# EasyEDA Pro project stm32f103c8t6.eprj

# Schematic Schematic1
Create Date: 2023-07-21; Page Name: P1; Project Name: stm32f103c8t6; Schematic Name: Schematic1; Update Date: 2023-07-23; Company: 嘉立创EDA; Page Size: A4; Version: V1.0
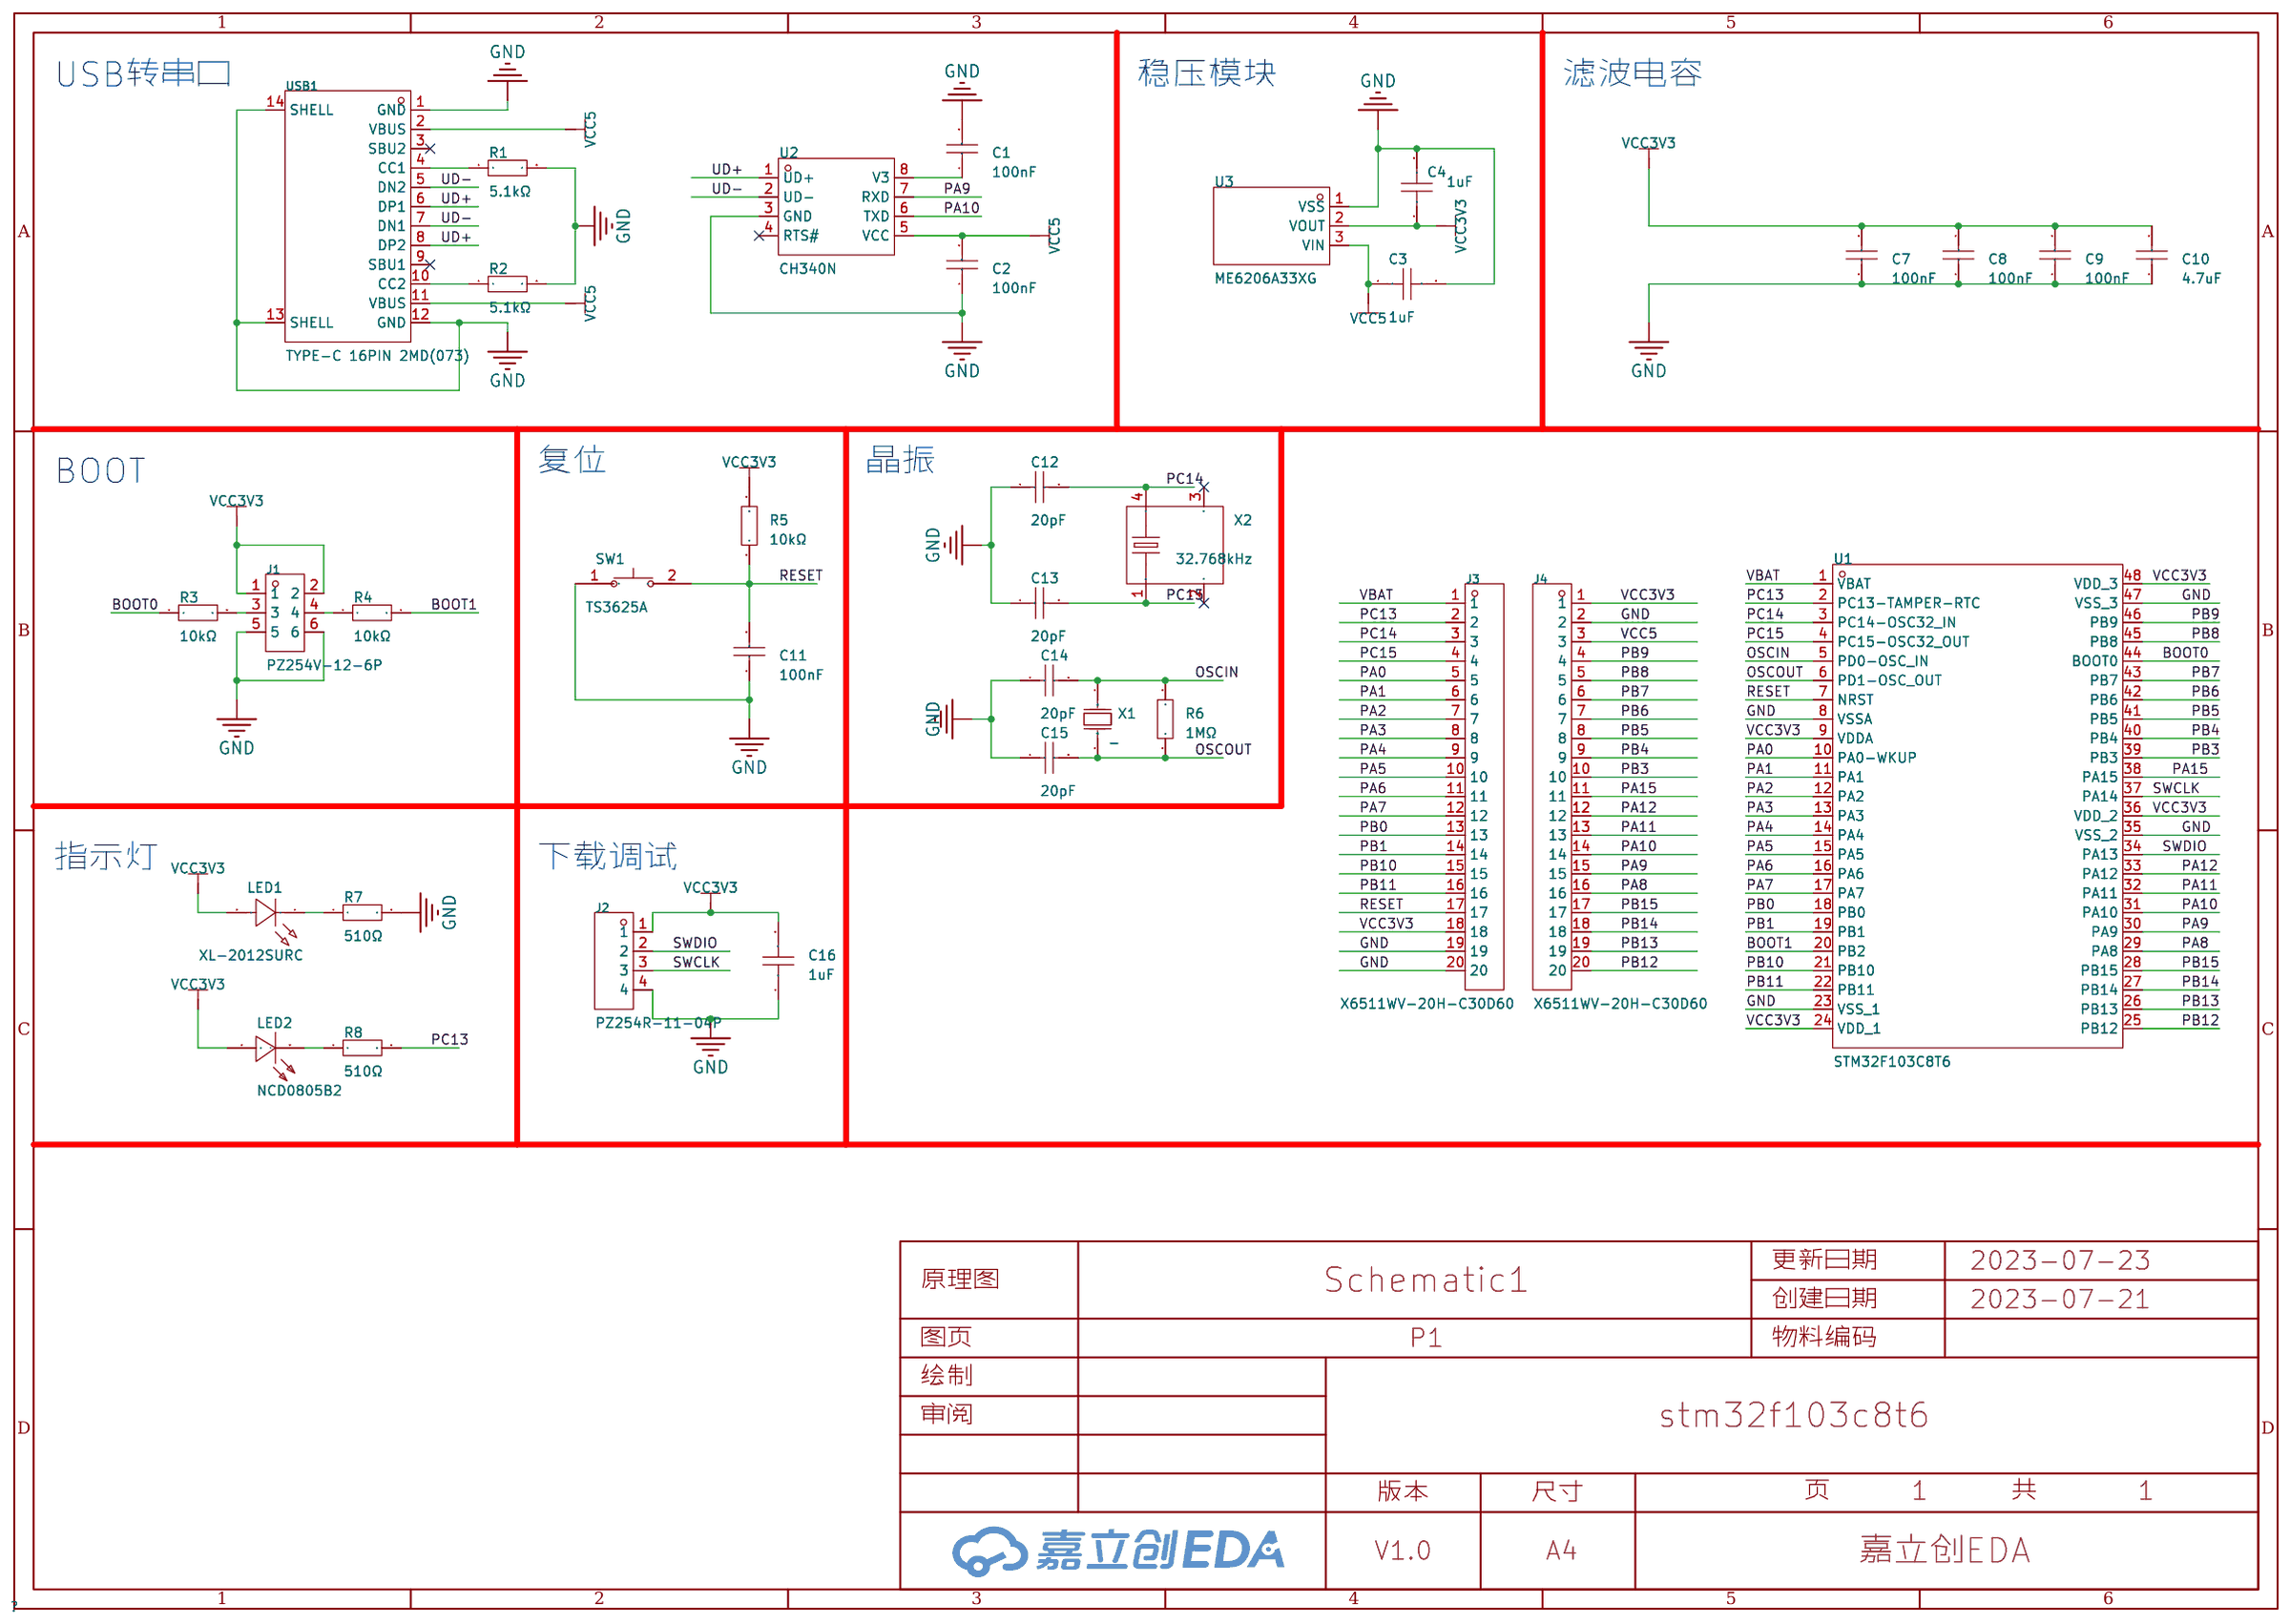
[diagram p0: schematic sheet]

## Parts
C1  100nF  [C0603]
C2  100nF  [C0603]
C3  1uF  [C0603]
C4  1uF  [C0603]
C7  100nF  [C0603]
C8  100nF  [C0603]
C9  100nF  [C0603]
C10  4.7uF  [C0603]
C11  100nF  [C0603]
C12  20pF  [C0603]
C13  20pF  [C0603]
C14  20pF  [C0603]
C15  20pF  [C0603]
C16  1uF  [C0603]
J1  PZ254V-12-6P  [HDR-TH_6P-P2.54-V-M-R2-C3-S2.54]
J2  PZ254R-11-04P  [HDR-TH_4P-P2.54-H-M-W10.4]
J3  X6511WV-20H-C30D60  [HDR-TH_20P-P2.54-V-M]
J4  X6511WV-20H-C30D60  [HDR-TH_20P-P2.54-V-M]
LED1  XL-2012SURC  [LED0805-RD_RED]
LED2  NCD0805B2  [LED0805-R-RD]
R1  5.1kΩ  [R0603]
R2  5.1kΩ  [R0603]
R3  10kΩ  [R0603]
R4  10kΩ  [R0603]
R5  10kΩ  [R0603]
R6  1MΩ  [R0603]
R7  510Ω  [R0603]
R8  510Ω  [R0603]
SW1  TS3625A  [KEY-SMD_L6.0-W3.5-LS8.4]
U1  STM32F103C8T6  [LQFP-48_L7.0-W7.0-P0.50-LS9.0-BL]
U2  CH340N  [SOP-8_L5.0-W4.0-P1.27-LS6.0-BL]
U3  ME6206A33XG  [SOT-23-3_L2.9-W1.6-P1.90-LS2.8-BR]
USB1  TYPE-C 16PIN 2MD(073)  [USB-C-SMD_TYPE-C-6PIN-2MD-073]
X1  -  [HC-49US_L11.5-W4.5-P4.88]
X2  32.768kHz  [MC-306_4P-L8.0-W3.2-P5.5-BL]

## Library data of the parts
C1 C2 C7-C9 C11 = 0603B104K500NT: 容值:100nF;精度:±10%;额定电压:50V;材质(温度系数):X7R;; LCSC Part Name: 100nF ±10% 50V; Supplier Part: C30926; Manufacturer: FH(风华); Supplier Footprint: 0603; JLCPCB Part Class: Extended Part; Datasheet: https://atta.szlcsc.com/upload/public/pdf/source/20170923/C30926_1506149436298988724.pdf; Supplier: LCSC; Tolerance: ±10%; Voltage Rated: 50V; Temperature Coefficient: X7R
C3 C4 C16 = 0603B105K500NT: 温度系数:X7R;精度:±10%;额定电压:50V;容值:1uF;; LCSC Part Name: 1uF(105) ±10% 50V; Supplier Part: C90540; Manufacturer: FH(风华); Supplier Footprint: 0603; JLCPCB Part Class: Extended Part; Datasheet: https://atta.szlcsc.com/upload/public/pdf/source/20170923/C90540_1506149560830988967.pdf; Supplier: LCSC; Temperature Coefficient: X7R; Tolerance: ±10%; Voltage Rated: 50V
C10 = CL10A475KO8NNNC: 容值:4.7uF;精度:±10%;额定电压:16V;材质(温度系数):X5R;; LCSC Part Name: 4.7uF ±10% 16V; Supplier Part: C19666; Manufacturer: SAMSUNG(三星); Supplier Footprint: 0603; JLCPCB Part Class: Basic Part; Datasheet: https://atta.szlcsc.com/upload/public/pdf/source/20160103/1457707703134.pdf; Supplier: LCSC; Tolerance: ±10%; Voltage Rated: 16V; Temperature Coefficient: X5R
C12-C15 = CC0603JRNPO9BN200: 容值:20pF;精度:±5%;额定电压:50V;材质(温度系数):NP0;; LCSC Part Name: 20pF ±5% 50V; Supplier Part: C105621; Manufacturer: YAGEO(国巨); Supplier Footprint: 0603; JLCPCB Part Class: Extended Part; Datasheet: https://atta.szlcsc.com/upload/public/pdf/source/20170425/1493115771885.pdf; Supplier: LCSC; Tolerance: ±5%; Voltage Rated: 50V; Temperature Coefficient: NP0
J1 = PZ254V-12-6P: 排数:双排;总PIN位数:6P;间距:2.54mm;插针结构:2x3P;行距:2.54mm;安装类型:直插;圆针/方针:方针;额定电流:-;额定电压:-;配合针长度:6mm;塑高:2.5mm;端接针长度:3mm;触头材质:黄铜;触头镀层:-;工作温度范围:-40℃~+105℃;颜色:黑色;; LCSC Part Name: 2.54mm 2x3P 直插 方针; Supplier Part: C492420; Manufacturer: XFCN(兴飞); Supplier Footprint: 插件,P=2.54mm; JLCPCB Part Class: Extended Part; Datasheet: https://atta.szlcsc.com/upload/public/pdf/source/20200309/C492420_BAECB307B001054C09D200388220EAE6.pdf; Supplier: LCSC; Number of Rows: 双排; Number of Pins: 6P; Pitch: 2.54mm; Pin Structure: 2x3P; Row Spacing: 2.54mm; Mounting Type: 直插; Circluar Pins/Square Pins: 方针; Length of Mating Pin: 6mm; Insulation Height: 2.5mm; Length of End Connection Pin: 3mm; Contact Material: 黄铜; Operating Temperature Range: -40℃~+105℃; Color: 黑色
J2 = PZ254R-11-04P: 间距:2.54mm;总PIN位数:4;排数:1;插针结构:1x4P;行距:-;安装类型:弯插;圆针/方针:方针;额定电流:-;额定电压:-;配合针长度:6mm;塑高:2.5mm;触头材质:黄铜;触头镀层:-;工作温度范围:-40℃~+105℃;颜色:黑色;; LCSC Part Name: 2.54mm 1x4P 弯插 方针; Supplier Part: C492412; Manufacturer: XFCN(兴飞); Supplier Footprint: 插件,P=2.54mm; JLCPCB Part Class: Extended Part; Supplier: LCSC; Pitch: 2.54mm; Number of Pins: 4; Number of Rows: 1; Pin Structure: 1x4P; Mounting Type: 弯插; Circluar Pins/Square Pins: 方针; Length of Mating Pin: 6mm; Insulation Height: 2.5mm; Contact Material: 黄铜; Operating Temperature Range: -40℃~+105℃; Color: 黑色
J3 J4 = X6511WV-20H-C30D60: 排数:单排;总PIN位数:20;间距:2.54mm;插针结构:1x20P;行距:-;安装类型:直插;圆针/方针:方针;额定电流:3A;额定电压:250V;配合针长度:6mm;塑高:2.5mm;端接针长度:3mm;触头材质:黄铜;触头镀层:金;工作温度范围:-40℃~+105℃;焊接温度(最大值):260℃;颜色:黑色;; LCSC Part Name: 2.54mm 1x20P 直插 方针; Supplier Part: C725952; Manufacturer: XKB Connectivity(中国星坤); Supplier Footprint: 插件,P=2.54mm; JLCPCB Part Class: Extended Part; Supplier: LCSC; Number of Rows: 单排; Number of Pins: 20; Pitch: 2.54mm; Pin Structure: 1x20P; Mounting Type: 直插; Circluar Pins/Square Pins: 方针; Current Rating (Max): 3A; Voltage Rating (Max): 250V; Length of Mating Pin: 6mm; Insulation Height: 2.5mm; Length of End Connection Pin: 3mm; Contact Material: 黄铜; Contact Plating: 金; Operating Temperature Range: -40℃~+105℃; Welding Temperature (Max): 260℃; Color: 黑色
LED1 = XL-2012SURC: 发光颜色:红灯;主波长:617nm~621nm;色温:-;功率:55mW;安装方式:正贴;; LCSC Part Name: 红灯 正贴; Supplier Part: C965812; Manufacturer: XINGLIGHT(成兴光); Supplier Footprint: 0805; JLCPCB Part Class: Extended Part; Datasheet: https://atta.szlcsc.com/upload/public/pdf/source/20221102/49E1A0A365644091E6270AF1C5E0FE37.pdf; Supplier: LCSC; Emitted Color: 红灯; Lens Color: 无色透明; Dominant Wavelength: 617nm~621nm; Peak Wavelength: 623nm; Forward Current: 25mA; Power Dissipation: 55mW; Viewing Angle: 120°; Mounting Sytle: 正贴; Operating Temperature: -30℃~+85℃
LED2 = NCD0805B2: 发光颜色:蓝灯;; LCSC Part Name: 蓝灯; Supplier Part: C84259; Manufacturer: 国星光电; Supplier Footprint: 0805; JLCPCB Part Class: Extended Part; Datasheet: https://atta.szlcsc.com/upload/public/pdf/source/20200820/C84259_E5AC6865415989C4C2C2831134BA3A23.pdf; Supplier: LCSC; Emitted Color: 蓝灯
R1 R2 = 0603WAF5101T5E: 电阻类型:厚膜电阻;阻值:5.1kΩ;精度:±1%;功率:100mW;; LCSC Part Name: 5.1kΩ ±1% 100mW; Supplier Part: C23186; Manufacturer: UNI-ROYAL(厚声); Supplier Footprint: 0603; JLCPCB Part Class: Basic Part; Datasheet: https://atta.szlcsc.com/upload/public/pdf/source/20200306/C422600_1E6D84923E4A46A82E41ADD87F860B5C.pdf; Supplier: LCSC; Type: 厚膜电阻; Tolerance: ±1%; Power(Watts): 100mW; Temperature Coefficient: ±100ppm/℃; Overload Voltage (Max): 75V; Operating Temperature Range: -55℃~+155℃
R3-R5 = 0603WAF1002T5E: 电阻类型:厚膜电阻;阻值:10kΩ;精度:±1%;功率:100mW;; LCSC Part Name: 厚膜电阻 10kΩ ±1% 100mW; Supplier Part: C25804; Manufacturer: UNI-ROYAL(厚声); Supplier Footprint: 0603; JLCPCB Part Class: Basic Part; Datasheet: https://atta.szlcsc.com/upload/public/pdf/source/20200306/C422600_1E6D84923E4A46A82E41ADD87F860B5C.pdf; Supplier: LCSC; Type: 厚膜电阻; Tolerance: ±1%; Power(Watts): 100mW; Temperature Coefficient: ±100ppm/℃; Overload Voltage (Max): 75V; Operating Temperature Range: -55℃~+155℃
R6 = 0603WAF1004T5E: 电阻类型:厚膜电阻;阻值:1MΩ;精度:±1%;功率:100mW;; LCSC Part Name: 1MΩ ±1% 100mW; Supplier Part: C22935; Manufacturer: UNI-ROYAL(厚声); Supplier Footprint: 0603; JLCPCB Part Class: Basic Part; Datasheet: https://atta.szlcsc.com/upload/public/pdf/source/20200306/C422600_1E6D84923E4A46A82E41ADD87F860B5C.pdf; Supplier: LCSC; Type: 厚膜电阻; Tolerance: ±1%; Power(Watts): 100mW; Temperature Coefficient: ±100ppm/℃; Overload Voltage (Max): 75V; Operating Temperature Range: -55℃~+155℃
R7 R8 = 0603WAF5100T5E: 电阻类型:厚膜电阻;阻值:510Ω;精度:±1%;功率:100mW;; LCSC Part Name: 510Ω ±1% 100mW; Supplier Part: C23193; Manufacturer: UNI-ROYAL(厚声); Supplier Footprint: 0603; JLCPCB Part Class: Basic Part; Datasheet: https://atta.szlcsc.com/upload/public/pdf/source/20200306/C422600_1E6D84923E4A46A82E41ADD87F860B5C.pdf; Supplier: LCSC; Type: 厚膜电阻; Tolerance: ±1%; Power(Watts): 100mW; Temperature Coefficient: ±100ppm/℃; Overload Voltage (Max): 75V; Operating Temperature Range: -55℃~+155℃
SW1 = TS3625A: 触点电流:50mA;额定电压(DC):12V;电路结构:单刀单掷;安装方式:立贴;带灯:-;作用力:250gf@±50gf;机械寿命:-;; LCSC Part Name: 6.1*3.65*2.5mm 立贴 轻触开关; Supplier Part: C398053; Manufacturer: SHOU HAN(首韩); Supplier Footprint: SMD; JLCPCB Part Class: Extended Part; Datasheet: https://atta.szlcsc.com/upload/public/pdf/source/20190620/C398053_EFFFB524A3F966B1F45EE8333D1EDECC.pdf; Supplier: LCSC; Contact Current: 50mA; Voltage Rating (DC): 12V; Circuit: 单刀单掷; Mounting Style: 立贴; Actuator Style: 矩形按钮; Operating Force: 250gf@±50gf; Switch Length: 6.1mm; Switch Width: 3.65mm; Switch Height: 2.5mm
U1 = STM32F103C8T6: CPU内核:ARM Cortex-M3;CPU最大主频:72MHz;程序存储容量:64KB;程序存储器类型:FLASH;RAM总容量:20KB;GPIO端口数量:37;; LCSC Part Name: ARM Cortex-M3 72MHz MSL=3; Supplier Part: C8734; Manufacturer: ST(意法半导体); Supplier Footprint: LQFP-48(7x7); JLCPCB Part Class: Basic Part; Datasheet: https://atta.szlcsc.com/upload/public/pdf/source/20220812/8363ACEC51AD55ECEB84799464F7CB85.pdf; Supplier: LCSC; CPU Core: ARM Cortex-M3; CPU Maximum Speed: 72MHz; Operating Voltage Range: 2V~3.6V; Program Storage Size: 64KB; Program Memory Type: FLASH; RAM Size: 20KB; GPIO Ports Number: 37; ADC (Bit): 12bit; Universal Serial Bus: 有; Peripheral/Function: 看门狗；DMA；看门狗；片载温度传感器; Watchdog: 有; Infrared Data Association: 有; Low-Voltage Detect: 有; Direct Memory Access: 有; Internal Oscillator: 有; Operating Temperature Range: -40℃~+85℃
U2 = CH340N_C506813: 应用功能:-;接口协议:-;; LCSC Part Name: USB转串口芯片 CH340; Supplier Part: C506813; Manufacturer: WCH(南京沁恒); Supplier Footprint: SOP-8; JLCPCB Part Class: Extended Part; Datasheet: https://atta.szlcsc.com/upload/public/pdf/source/20200819/C84681_ADBED554CE321879DBD6B1D06488689C.pdf; Supplier: LCSC
U3 = ME6206A33XG: 输出类型:固定;输出极性:正;最大输入电压:6V;输出电压:3.3V;输出电流:300mA;电源纹波抑制比(PSRR):50dB@(1kHz);; LCSC Part Name: 输入6V 输出3.3V 300mA; Supplier Part: C161345; Manufacturer: MICRONE(南京微盟); Supplier Footprint: SOT-23; JLCPCB Part Class: Extended Part; Datasheet: https://atta.szlcsc.com/upload/public/pdf/source/20180207/C161345_15179949863651359188.pdf; Supplier: LCSC; Output Type: 固定; Output Polarity: 正; Number of Outputs: 1; Maximum Input Voltage: 6V; Output Voltage: 3.3V; Dropout Voltage: 400mV@(200mA); Output Current: 300mA; Power Supply Rejection Ratio (PSRR): 50dB@(1kHz)
USB1 = TYPE-C 16PIN 2MD(073): 连接器类型:Type-C;标准:-;公母:母座;触点数量:16;端口数量:1;安装方式:卧贴;额定电流 - 电源:5A;工作温度范围:-25℃~+85℃;; LCSC Part Name: TYPE-C母座 16P 4脚插件带定位柱 不锈钢外壳 2次模顶; Supplier Part: C2765186; Manufacturer: SHOU HAN(首韩); Supplier Footprint: SMD; JLCPCB Part Class: Extended Part; Supplier: LCSC; Connector Type: Type-C; Gender: 母座; Number of Contacts: 16; Number of Ports: 1; Mounting Style: 卧贴; Current Rating - Power (Max): 5A; Operating Temperature Range: -25℃~+85℃
X1 = XIHCELNANF-8MHZ: 频率:-;负载电容:-;; LCSC Part Name: 8MHZ 20PF30PPM -40℃~+85℃DIP; Supplier Part: C295088; Manufacturer: TAITIEN(泰艺电子); Supplier Footprint: HC-49S; JLCPCB Part Class: Extended Part; Datasheet: https://atta.szlcsc.com/upload/public/pdf/source/20180928/C295088_870B1C8FD6918B666D832F79126576C6.pdf; Supplier: LCSC; Frequency Tolerance: ±20ppm; Frequency Stability: ±30ppm
X2 = Q13MC3062000600: 频率:32.768kHz;频率公差:±20ppm;负载电容:6pF;; LCSC Part Name: 32.768kHz ±20ppm 6pF; Supplier Part: C83979; Manufacturer: EPSON(爱普生); Supplier Footprint: MC-306; JLCPCB Part Class: Extended Part; Datasheet: https://atta.szlcsc.com/upload/public/pdf/source/20161024/1477288588328.pdf; Supplier: LCSC; Crystal Type: 贴片无源晶振; Frequency Tolerance: ±20ppm; Load Capacitance: 6pF; Equivalent Series Resistance (ESR): 35kΩ; Operating Temperature: -40℃~+85℃

## Nets
GND: C1.2 C2.1 C3.2 C4.2 C7.1 C8.1 C9.1 C10.1 C11.1 C12.1 C13.1 C14.1 C15.1 C16.1 J1.5 J1.6 J2.4 J3.19 J3.20 J4.2 LED1.1(K) R1.2 R2.2 R7.1 R7.2 SW1.1 U1.8(VSSA) U1.23(VSS_1) U1.35(VSS_2) U1.47(VSS_3) U2.3(GND) U3.1(VSS) USB1.1(GND) USB1.12(GND) USB1.13(SHELL) USB1.14(SHELL)
VBAT: J3.1 U1.1(VBAT)
VCC3V3: C4.1 C7.2 C8.2 C9.2 C10.2 C16.2 J1.1 J1.2 J2.1 J3.18 J4.1 LED1.2(A) LED2.1(+) R5.2 U1.9(VDDA) U1.24(VDD_1) U1.36(VDD_2) U1.48(VDD_3) U3.2(VOUT)
VCC5: C2.2 C3.1 J4.3 U2.5(VCC) U3.3(VIN) USB1.2(VBUS) USB1.11(VBUS)
BOOT0: R3.1 U1.44(BOOT0)
BOOT1: R4.2 U1.20(PB2)
OSCIN: C14.2 R6.2 U1.5(PD0-OSC_IN) X1.1(OSC1)
OSCOUT: C15.2 R6.1 U1.6(PD1-OSC_OUT) X1.2(OSC2)
PA0: J3.5 U1.10(PA0-WKUP)
PA1: J3.6 U1.11(PA1)
PA2: J3.7 U1.12(PA2)
PA3: J3.8 U1.13(PA3)
PA4: J3.9 U1.14(PA4)
PA5: J3.10 U1.15(PA5)
PA6: J3.11 U1.16(PA6)
PA7: J3.12 U1.17(PA7)
PA8: J4.16 U1.29(PA8)
PA9: J4.15 U1.30(PA9) U2.7(RXD)
PA10: J4.14 U1.31(PA10) U2.6(TXD)
PA11: J4.13 U1.32(PA11)
PA12: J4.12 U1.33(PA12)
PA15: J4.11 U1.38(PA15)
PB0: J3.13 U1.18(PB0)
PB1: J3.14 U1.19(PB1)
PB3: J4.10 U1.39(PB3)
PB4: J4.9 U1.40(PB4)
PB5: J4.8 U1.41(PB5)
PB6: J4.7 U1.42(PB6)
PB7: J4.6 U1.43(PB7)
PB8: J4.5 U1.45(PB8)
PB9: J4.4 U1.46(PB9)
PB10: J3.15 U1.21(PB10)
PB11: J3.16 U1.22(PB11)
PB12: J4.20 U1.25(PB12)
PB13: J4.19 U1.26(PB13)
PB14: J4.18 U1.27(PB14)
PB15: J4.17 U1.28(PB15)
PC13: J3.2 R8.2 U1.2(PC13-TAMPER-RTC)
PC14: C12.2 J3.3 U1.3(PC14-OSC32_IN) X2.4
PC15: C13.2 J3.4 U1.4(PC15-OSC32_OUT) X2.1
RESET: C11.2 J3.17 R5.1 SW1.2 U1.7(NRST)
SWCLK: J2.3 U1.37(PA14)
SWDIO: J2.2 U1.34(PA13)
UD+: U2.1(UD+) USB1.6(DP1) USB1.8(DP2)
UD-: U2.2(UD-) USB1.5(DN2) USB1.7(DN1)
$1N6641: R1.1 USB1.4(CC1)
$1N6644: R2.1 USB1.10(CC2)
$1N6955: C1.1 U2.8(V3)
$1N7700: J1.3 R3.2
$1N7707: J1.4 R4.1
$1N8347: LED2.2(-) R8.1

Not connected (* = marked no-connect by the designer): U2 4(RTS#)*; USB1 3(SBU2)* 9(SBU1)*; X2 2* 3*

## Notes on the sheet
- USB转串口
- 稳压模块
- 滤波电容
- 复位
- 晶振
- BOOT
- 指示灯
- 下载调试

# Board PCB1
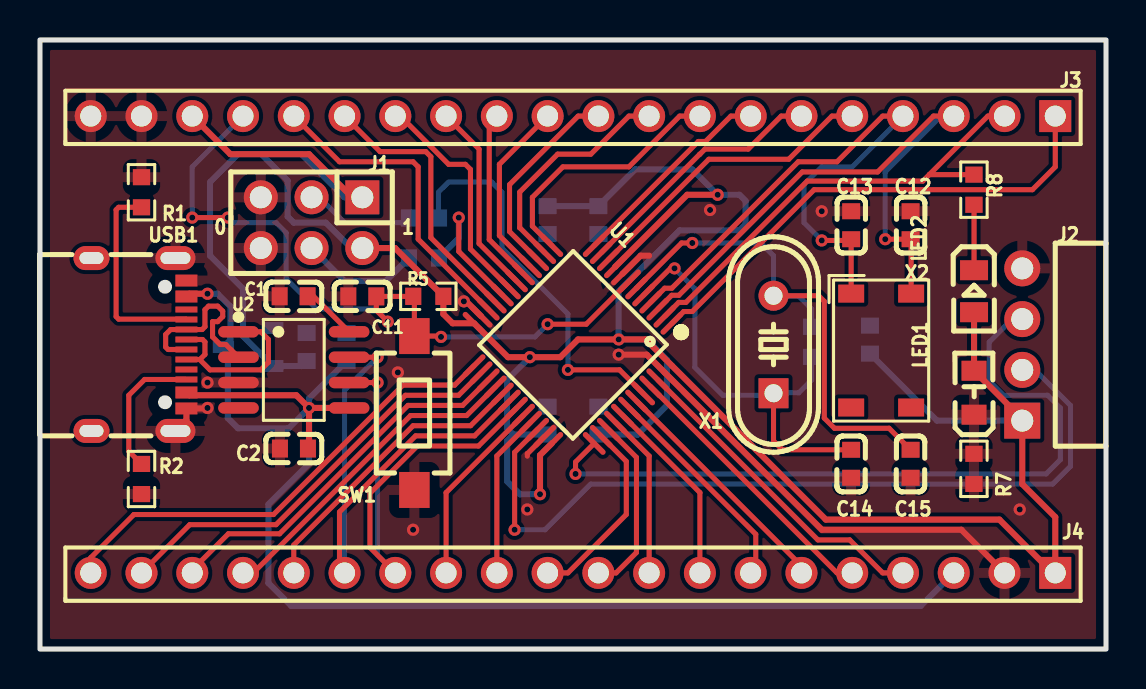
[diagram p1: board, top side]
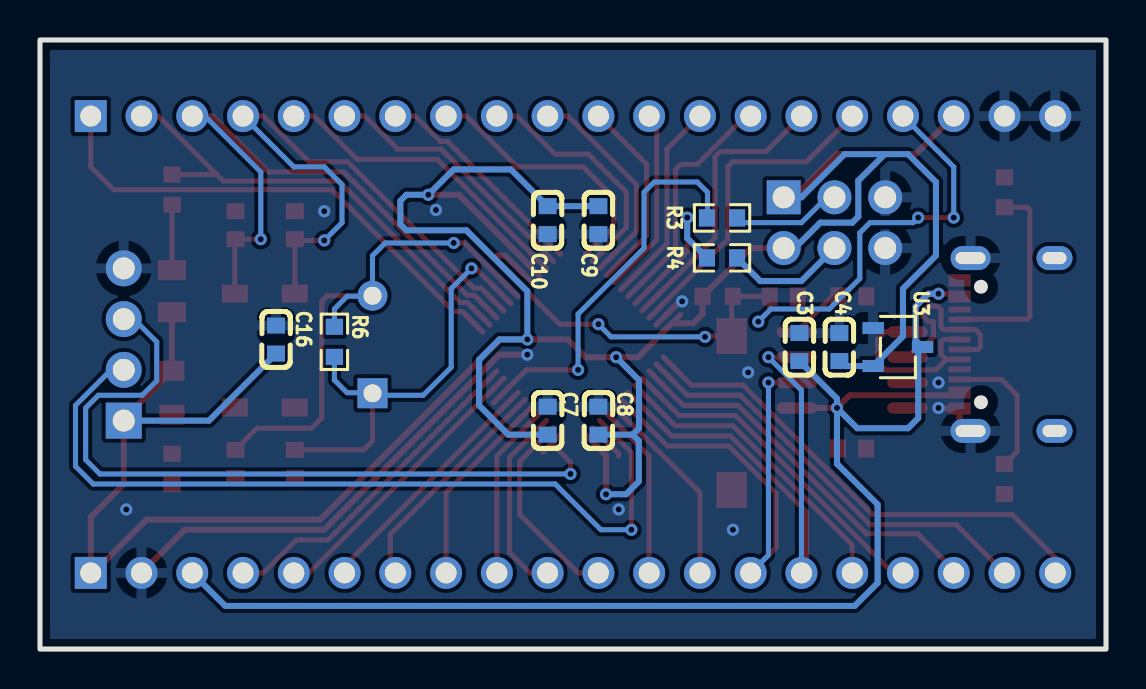
[diagram p2: board, bottom side, seen from below]

Outline 53.34 x 30.48 mm; copper layers: Top Layer, Bottom Layer. Coordinates in mm from the lower left corner of the outline.
Outline path: rectangle 0,30.48 53.34,0
Stack: Top Layer 0.035mm / Dielectric1 1.51mm FR4 er 4.5 / Bottom Layer 0.035mm

## Design rules (mm)
net UD-: DP1
net UD+: DP1
template: JLCPCB Capability(Two Layers Board)
spacing copperThickness1oz (default): track to track 0.102, other pairs 0.152 to 0.3
spacing copperThickness2oz: track to track 0.203, other pairs 0.152 to 0.3
track width copperThickness1oz (default): min 0.127, default 0.254, max 2.54
track width copperThickness2oz: min 0.203, default 0.254, max 2.54
differential pair differentialPair (default): width min 0.127, default 0.254, max 2.54; gap min 0.152, default 0.152
via viaSize (default): diameter min 0.5, default 0.61, max 10; hole min 0.3, default 0.305, max 6.3

## Placement (name value [footprint] x y rotation side)
C1  100nF  [C0603]  12.69 17.65 180 top
C2  100nF  [C0603]  12.71 10.03 0 top
C3  1uF  [C0603]  15.34 15.11 90 bottom
C4  1uF  [C0603]  13.34 15.11 90 bottom
C7  100nF  [C0603]  27.94 11.43 270 bottom
C8  100nF  [C0603]  25.4 11.43 270 bottom
C9  100nF  [C0603]  25.4 21.46 90 bottom
C10  4.7uF  [C0603]  27.94 21.46 90 bottom
C11  100nF  [C0603]  16.13 17.65 0 top
C12  20pF  [C0603]  43.56 21.21 270 top
C13  20pF  [C0603]  40.59 21.21 270 top
C14  20pF  [C0603]  40.59 9.27 90 top
C15  20pF  [C0603]  43.56 9.27 90 top
C16  1uF  [C0603]  41.53 15.49 270 bottom
J1  PZ254V-12-6P  [HDR-TH_6P-P2.54-V-M-R2-C3-S2.54]  13.59 21.34 180 top
J2  PZ254R-11-04P  [HDR-TH_4P-P2.54-H-M-W10.4]  49.15 15.24 90 top
J3  X6511WV-20H-C30D60  [HDR-TH_20P-P2.54-V-M]  26.67 26.67 180 top
J4  X6511WV-20H-C30D60  [HDR-TH_20P-P2.54-V-M]  26.67 3.81 180 top
LED1  XL-2012SURC  [LED0805-RD_RED]  46.74 12.83 90 top
LED2  NCD0805B2  [LED0805-R-RD]  46.74 17.91 270 top
R1  5.1kΩ  [R0603]  5.08 22.86 90 top
R2  5.1kΩ  [R0603]  5.08 8.51 270 top
R3  10kΩ  [R0603]  19.21 21.57 180 bottom
R4  10kΩ  [R0603]  19.21 19.57 0 bottom
R5  10kΩ  [R0603]  19.43 17.65 0 top
R6  1MΩ  [R0603]  38.61 15.37 270 bottom
R7  510Ω  [R0603]  46.73 9.02 270 top
R8  510Ω  [R0603]  46.73 22.99 90 top
SW1  TS3625A  [KEY-SMD_L6.0-W3.5-LS8.4]  18.73 11.81 90 top
U1  STM32F103C8T6  [LQFP-48_L7.0-W7.0-P0.50-LS9.0-BL]  26.67 15.24 135 top
U2  CH340N  [SOP-8_L5.0-W4.0-P1.27-LS6.0-BL]  12.7 13.97 270 top
U3  ME6206A33XG  [SOT-23-3_L2.9-W1.6-P1.90-LS2.8-BR]  10.41 15.11 0 bottom
USB1  TYPE-C 16PIN 2MD(073)  [USB-C-SMD_TYPE-C-6PIN-2MD-073]  4.95 15.24 270 top
X1  -  [HC-49US_L11.5-W4.5-P4.88]  36.7 15.24 90 top
X2  32.768kHz  [MC-306_4P-L8.0-W3.2-P5.5-BL]  42.16 15.24 270 top

## Footprints (pads in the part's own frame, mm; a bottom-side part is the same pattern mirrored in y, then rotated)
C0603
  rect 0.8x0.9 smd: 1(-0.7,0) 2(0.7,0)
HC-49US_L11.5-W4.5-P4.88
  rect 1.5x1.5 hole 0.9: 1(-2.44,0)
  round 1.5 hole 0.9: 2(2.44,0)
HDR-TH_4P-P2.54-H-M-W10.4
  rect 1.8x1.8 hole 1.1: 1(-3.81,0)
  round 1.8 hole 1.1: 2(-1.27,0) 3(1.27,0) 4(3.81,0)
HDR-TH_6P-P2.54-V-M-R2-C3-S2.54
  rect 1.7x1.7 hole 1.1: 1(-2.54,-1.27)
  round 1.7 hole 1.1: 2(-2.54,1.27) 3(0,-1.27) 4(0,1.27) 5(2.54,-1.27) 6(2.54,1.27)
HDR-TH_20P-P2.54-V-M
  rect 1.6x1.6 hole 1.05: 1(-24.13,0)
  round 1.6 hole 1.05: 2(-21.59,0) 3(-19.05,0) 4(-16.51,0) 5(-13.97,0) 6(-11.43,0) 7(-8.89,0) 8(-6.35,0) 9(-3.81,0) 10(-1.27,0) 11(1.27,0) 12(3.81,0) 13(6.35,0) 14(8.89,0) 15(11.43,0) 16(13.97,0) 17(16.51,0) 18(19.05,0) 19(21.59,0) 20(24.13,0)
KEY-SMD_L6.0-W3.5-LS8.4
  rect 1.8x1.524 smd: 1(-3.85,0) 2(3.85,0)
LED0805-R-RD
  rect 1x1.399 smd: 1(1.05,0) 2(-1.05,0)
LED0805-RD_RED
  rect 1x1.25 smd: 1(-1.1,0) 2(1.1,0)
LQFP-48_L7.0-W7.0-P0.50-LS9.0-BL
  oval 0.27x1.5 smd: 1(-2.75,-4.25) 2(-2.25,-4.25) 3(-1.75,-4.25) 4(-1.25,-4.25) 5(-0.75,-4.25) 6(-0.25,-4.25) 7(0.25,-4.25) 8(0.75,-4.25) 9(1.25,-4.25) 10(1.75,-4.25) 11(2.25,-4.25) 12(2.75,-4.25) 25(2.75,4.25) 26(2.25,4.25) 27(1.75,4.25) 28(1.25,4.25) 29(0.75,4.25) 30(0.25,4.25) 31(-0.25,4.25) 32(-0.75,4.25) 33(-1.25,4.25) 34(-1.75,4.25) 35(-2.25,4.25) 36(-2.75,4.25)
  oval 1.5x0.27 smd: 13(4.25,-2.75) 14(4.25,-2.25) 15(4.25,-1.75) 16(4.25,-1.25) 17(4.25,-0.75) 18(4.25,-0.25) 19(4.25,0.25) 20(4.25,0.75) 21(4.25,1.25) 22(4.25,1.75) 23(4.25,2.25) 24(4.25,2.75) 37(-4.25,2.75) 38(-4.25,2.25) 39(-4.25,1.75) 40(-4.25,1.25) 41(-4.25,0.75) 42(-4.25,0.25) 43(-4.25,-0.25) 44(-4.25,-0.75) 45(-4.25,-1.25) 46(-4.25,-1.75) 47(-4.25,-2.25) 48(-4.25,-2.75)
MC-306_4P-L8.0-W3.2-P5.5-BL
  rect 0.9x1.3 smd: 1(-2.545,-1.576) 2(3.155,-1.576) 3(3.155,1.424) 4(-2.545,1.424)
R0603
  rect 0.806x0.864 smd: 1(-0.753,0) 2(0.753,0)
SOP-8_L5.0-W4.0-P1.27-LS6.0-BL
  oval 0.574x2.035 smd: 1(-1.905,-2.768) 2(-0.635,-2.768) 3(0.635,-2.768) 4(1.905,-2.768) 5(1.905,2.768) 6(0.635,2.768) 7(-0.635,2.768) 8(-1.905,2.768)
SOT-23-3_L2.9-W1.6-P1.90-LS2.8-BR
  rect 1.07x0.6 smd: 1(1.235,-0.95) 2(1.235,0.95) 3(-1.235,0)
USB-C-SMD_TYPE-C-6PIN-2MD-073
  rect 0.6x1.1 smd: 1(-3.2,2.375) 2(-2.4,2.375) 11(2.4,2.375) 12(3.2,2.375)
  rect 0.3x1.1 smd: 3(-1.75,2.375) 4(-1.25,2.375) 5(-0.75,2.375) 6(-0.25,2.375) 7(0.25,2.375) 8(0.75,2.375) 9(1.25,2.375) 10(1.75,2.375)
  oval 1.2x2 hole 0.6x1.5: 13(-4.325,1.825) 14(4.325,1.825)
  oval 1.2x1.8 hole 0.6x1.2: 13(-4.325,-2.375) 14(4.325,-2.375)

## Nets
As in the schematic.

Pads without a net: U2 4; USB1 3 9; X2 2 3

## Via types
v1: diameter 0.61, hole 0.305, Top Layer to Bottom Layer, 31 vias

## Routing (per net, layer and track width the routed paths; a pad name or vN(x,y) marks a point on that pad's centre or on a via; arc(x,y) is an arc through that point)
GND: length 30.2
  Top Layer w0.254: 24.38,9.65 24.38,9.78 24.39,9.78 25.26,10.64
  Top Layer w0.305: 8.13,12.04 7.33,12.04 7.33,11.47 6.78,10.92 ; 30.48,19.69 30.05,19.69 U1.8 ; 22.07,16.65 21.33,17.4 v1(21.21,17.4) ; J4.2 46.1,5.97 39.12,5.97 U1.47 30.36,14.73 v1(28.96,14.73)
  vias: v1(8.38,13.33) v1(8.38,12.06) v1(17.91,13.84) v1(18.67,5.97) v1(24.38,6.98) v1(33.53,21.97) v1(39.12,21.91) v1(49.02,6.98)
VBAT: length 25
  Top Layer w0.254: J3.1 50.8,24.13 49.66,22.99 38.73,22.99 32.64,16.89 32.21,16.89 U1.1
VCC3V3: length 157.8
  Top Layer w0.305: v1(25.02,7.75) 25.02,9.7 U1.36 ; U1.9 28.79,19.14 32.39,22.73 v1(33.91,22.73) ; LED2.1 LED1.2 49.15,11.51 J2.1 49.15,8.25 50.8,6.6 J4.1 50.67,3.81 48.01,6.48 39.32,6.48 U1.48 30.3,15.49 v1(28.96,15.49) 26.92,15.49 26.03,14.61 v1(24.51,14.61) 23.42,14.61 U1.24 20.65,16.3 20.18,16.76 R5.2 17.77,20.07 J1.2 ; J3.18 9.52,24.77 13.46,24.77 15.62,22.61 J1.1
  Bottom Layer w0.305: C7.2 29.91,10.73 31.37,12.19 31.37,14.48 30.35,15.49 v1(28.96,15.49) 28.96,17.91 32,20.95 35,20.95 35.31,21.26 35.31,22.43 35,22.73 v1(33.91,22.73) 32.64,24 29.78,24 C10.2 C9.2 ; J2.1 44.89,11.43 41.53,14.79 ; C4.1 13.09,14.16 U3.2 10.16,15.65 10.16,18.03 8.51,19.69 8.51,23.37 9.91,24.77 11.07,24.77 ; 11.07,24.77 12.39,23.44 12.39,21.64 12.7,21.34 14.3,21.34 15.57,20.07 J1.2 ; 11.07,24.77 13.08,24.77 15.24,22.61 J1.1 ; v1(25.02,7.75) 24.01,7.75 23.38,8.38 23.38,10.42 23.68,10.73 ; C8.2 23.68,10.73 ; 23.68,10.73 23.37,11.05 23.37,13.46 v1(24.51,14.61)
VCC5: length 71.7
  Top Layer w0.305: v1(13.46,12.06) U2.5 ; v1(13.46,12.06) 13.46,10.09 C2.2 ; v1(13.46,12.06) 12.83,12.7 7.47,12.7 7.33,12.84 ; v1(8.38,17.78) 7.47,17.78 USB1.2
  Bottom Layer w0.305: v1(8.38,17.78) 8.89,17.78 9.52,17.14 9.52,15.46 U3.3 9.4,14.89 9.4,11.56 9.91,11.05 12.45,11.05 v1(13.46,12.06) ; v1(13.46,12.06) 13.46,12.53 C3.1 ; v1(13.46,12.06) 13.46,9.27 11.43,7.24 11.43,3.3 12.57,2.16 44.07,2.16 45.72,3.81
BOOT0: length 19.4
  Top Layer w0.254: U1.44 29,13.97 v1(26.42,13.97)
  Bottom Layer w0.254: R3.1 19.94,21.6 19.94,22.86 20.45,23.37 22.61,23.37 23.11,22.86 23.11,20.07 26.42,16.76 v1(26.42,13.97)
BOOT1: length 7.2
  Top Layer w0.254: U1.20 20.95,19.89 v1(20.95,21.59)
  Bottom Layer w0.305: v1(20.95,21.59) 20.95,20.56 R4.2
OSCIN: length 21.8
  Top Layer w0.254: X1.1 36.7,10.41 37.15,9.97 C14.2 ; U1.5 31.54,19.05 v1(31.75,19.05)
  Bottom Layer w0.254: R6.2 38.61,13.46 37.97,12.83 36.73,12.83 X1.1 36.6,12.7 34.16,12.7 32.77,14.1 32.77,18.03 v1(31.75,19.05)
OSCOUT: length 26.6
  Top Layer w0.254: v1(32.64,20.32) 32.1,20.32 U1.6 29.88,18.07 ; 36.7,17.68 38.96,17.68 39.24,17.4 39.24,11.56 39.75,11.05 42.48,11.05 C15.2
  Bottom Layer w0.254: v1(32.64,20.32) 36.07,20.32 36.7,19.69 36.7,17.68 36.73,17.65 37.97,17.65 38.61,17.02 R6.1
PA0: length 15.2
  Top Layer w0.254: J3.5 39.63,26.67 37.47,24.51 33.47,24.51 U1.10
PA1: length 12.8
  Top Layer w0.254: J3.6 37.09,26.67 35.44,25.02 33.27,25.02 33.02,24.77 33.01,24.77 28.08,19.84
PA2: length 10.5
  Top Layer w0.254: U1.12 32.94,25.4 33.3,25.4 34.57,26.67 35.56,26.67
PA3: length 12.9
  Top Layer w0.254: J3.8 32.01,26.67 29.47,24.13 26.16,24.13 24.64,22.61 24.64,21.16 U1.13
PA4: length 11.6
  Top Layer w0.254: U1.14 24.01,21.08 24,21.08 24,22.87 25.9,24.77 27.56,24.77 29.47,26.67 J3.9
PA5: length 10.2
  Top Layer w0.254: 27.94,26.67 26.93,26.67 23.49,23.24 23.49,20.89 U1.15
PA6: length 9.2
  Top Layer w0.254: J3.11 22.99,24.26 22.99,20.69 U1.16
PA7: length 8.8
  Top Layer w0.254: J3.12 22.48,26.29 22.48,20.49 U1.17
PA8: length 15
  Top Layer w0.254: J4.16 12.7,5.21 18.67,11.18 21.55,11.18 U1.29
PA9: length 26.9
  Top Layer w0.254: J4.15 14.99,4.06 14.99,6.86 18.8,10.67 21.74,10.67 23.49,12.41 ; U2.7 v1(16.89,14.61)
  Bottom Layer w0.254: J4.15 15.24,12.95 v1(16.89,14.61)
PA10: length 24.9
  Top Layer w0.254: 23.84,12.06 21.94,10.16 18.87,10.16 16.51,7.8 16.51,5.08 J4.14 ; U2.6 v1(16.89,13.33)
  Bottom Layer w0.254: J4.14 16.89,4.7 v1(16.89,13.33)
PA11: length 9.5
  Top Layer w0.254: J4.13 20.32,7.83 U1.32
PA12: length 8.2
  Top Layer w0.254: U1.33 22.86,9.66 J4.12
PA15: length 9.6
  Top Layer w0.254: 28.08,10.64 29.34,9.39 29.34,6.73 26.41,3.81 J4.11
PB0: length 9.7
  Top Layer w0.254: J3.13 21.97,25.02 21.97,20.29 U1.18
PB1: length 11.6
  Top Layer w0.254: J3.14 18.03,26.67 20.45,24.26 21.29,24.26 21.54,24 21.54,20.02 23.49,18.07
PB3: length 9.1
  Top Layer w0.254: U1.39 29.84,9.59 29.84,4.83 28.82,3.81 27.94,3.81
PB4: length 8.2
  Top Layer w0.254: J4.9 30.48,9.66 U1.40
PB5: length 9.5
  Top Layer w0.254: U1.41 33.02,7.83 J4.8
PB6: length 11
  Top Layer w0.254: 35.56,3.81 35.81,4.06 35.81,5.74 29.5,12.06
PB7: length 12
  Top Layer w0.254: J4.6 38.1,4.16 U1.43
PB8: length 13.9
  Top Layer w0.254: J4.5 39.88,3.81 30.57,13.12 U1.45
PB9: length 16.3
  Top Layer w0.254: J4.4 42.17,3.81 40.52,5.46 38.92,5.46 U1.46
PB10: length 13.8
  Top Layer w0.254: J3.15 17.02,24.89 19.3,24.89 19.56,24.64 19.56,20.58 U1.21
PB11: length 15.8
  Top Layer w0.254: J3.16 14.99,24.38 18.67,24.38 18.92,24.13 18.92,20.51 U1.22
PB12: length 23.9
  Top Layer w0.254: U1.25 20.75,13.21 18.16,13.21 11.68,6.73 4.7,6.73 2.54,4.57 2.54,3.81
PB13: length 21.1
  Top Layer w0.254: 22.07,13.83 20.95,12.7 18.29,12.7 11.81,6.22 7.49,6.22 J4.19
PB14: length 18.9
  Top Layer w0.254: J4.18 7.62,3.96 9.42,5.77 11.99,5.77 18.41,12.19 21.15,12.19 U1.27
PB15: length 16.5
  Top Layer w0.254: U1.28 21.35,11.68 18.54,11.68 10.67,3.81 10.16,3.81
PC13: length 23.4
  Top Layer w0.254: R8.2 44.51,23.74 44.51,23.75 ; 31.27,16.65 31.96,17.35 32.32,17.35 38.39,23.42 44.17,23.42 44.51,23.75 ; J3.2 47.43,26.67 44.51,23.75
PC14: length 30.8
  Top Layer w0.254: 45.72,26.67 44.71,26.67 41.91,23.88 38.14,23.88 31.97,17.7 31.61,17.7 U1.3 ; X2.4 43.59,20.48 C12.2 v1(42.29,20.51)
  Bottom Layer w0.254: 45.72,26.67 45.08,26.67 42.29,23.88 v1(42.29,20.51)
PC15: length 30.2
  Top Layer w0.254: v1(39.12,20.45) 40.53,20.45 C13.2 X2.1 ; J3.4 42.17,26.67 39.88,24.38 37.94,24.38 31.61,18.06 31.26,18.06 U1.4
  Bottom Layer w0.254: J3.4 40.64,24.13 39.12,24.13 38.23,23.24 38.23,21.34 v1(39.12,20.45)
RESET: length 36.7
  Top Layer w0.254: v1(17.4,16.38) 16.83,16.95 C11.2 18.67,17.65 R5.1 18.73,17.59 SW1.2 20.03,15.66 v1(20.07,15.62) ; v1(25.4,16.26) 27.33,16.26 U1.7 ; v1(7.62,21.59) v1(9.4,21.59)
  Bottom Layer w0.254: v1(9.4,21.59) 9.65,21.34 11.81,21.34 12.32,20.83 12.32,18.54 13.84,17.02 16.76,17.02 v1(17.4,16.38) ; 10.16,26.67 7.62,24.13 v1(7.62,21.59) ; v1(25.4,16.26) 24.77,15.62 v1(20.07,15.62)
SWCLK: length 37.2
  Top Layer w0.254: v1(26.8,8.76) 26.8,9.36 U1.37
  Bottom Layer w0.254: v1(26.8,8.76) 50.34,8.76 51.05,9.47 51.05,12.06 50.42,12.7 48.22,12.7 47.5,13.43 47.5,15.37 48.64,16.51 J2.3
SWDIO: length 40.8
  Top Layer w0.254: U1.34 23.75,9.84 v1(23.75,5.97)
  Bottom Layer w0.254: J2.2 49.78,13.97 51.56,12.19 51.56,9.14 50.67,8.25 27.56,8.25 25.27,5.97 v1(23.75,5.97)
UD+: length 9.2
  Top Layer w0.254: 9.94,15.88 11.05,15.88 11.43,15.49 11.43,14.35 11.05,13.97 8.51,13.97 7.99,14.49 ; 7.99,14.49 8.01,14.49 8.26,14.74 8.26,15.37 8.13,15.49 USB1.6 ; 7.99,14.49 USB1.8
UD-: length 9
  Top Layer w0.254: 7.22,14.99 6.41,14.99 6.29,15.11 6.29,15.74 6.54,15.99 USB1.5 8.12,15.99 8.26,16.13 8.26,16.98 8.44,17.16 8.89,17.16 9.14,16.91 9.14,16.64 8.89,16.38 8.64,16.38 8.64,15.62 9.02,15.24 9.3,15.24 U2.2
$1N6641: length 10.2
  Top Layer w0.254: USB1.4 7.31,16.51 3.94,16.51 3.81,16.64 3.81,21.98 3.94,22.11 R1.1
$1N6644: length 6.9
  Top Layer w0.254: R2.1 4.45,9.9 4.45,12.7 5.23,13.49 USB1.10
$1N6955: length 2.8
  Top Layer w0.254: C1.1 13.69,17.65 U2.8
$1N7700: length 5.5
  Bottom Layer w0.254: J1.3 13.97,22.61 15.24,21.34 18.22,21.34 R3.2
$1N7707: length 6
  Bottom Layer w0.305: J1.4 15.24,18.42 17.3,18.42 R4.1
$1N8347: length 3.3
  Top Layer w0.254: R8.1 46.74,22.23 LED2.2

## Copper pours and planes (outline as drawn; the poured copper is in the pictures)
GND on Top Layer: 0,30.48 53.34,30.48 53.34,0 0,0
GND on Bottom Layer: 0,30.48 53.34,30.48 53.34,0 0,0

## Text on the board
Top Silkscreen Layer: 0 | 1
